# EAGLE design stamp-fixed-mk2 (EAGLE 6.5.0)
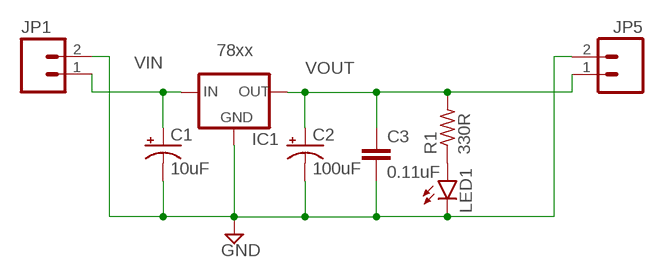
[diagram p0: schematic, sheet 1]

## Parts
C1  10uF  CAPACITOR-POLARIZEDE2.5-6  [E2,5-6]
C2  100uF  CAPACITOR-POLARIZEDE2.5-6  [E2,5-6]
C3  0.11uF  CAPACITOR-CERAMIC025-024X044  [C025-024X044]
IC1  78xx  V_REG_78XXTO-220-THERM  [TO-220-SIDE-THERM]
JP1  M02JST-PTH-2  [JST-2-PTH]
JP5  M02JST-PTH-2  [JST-2-PTH]
LED1  LED3MM  [LED3MM]
R1  330R  RESISTORPTH-AXIAL-5.08MM  [RESISTOR-AXIAL-PTH-5.08MM]

## Nets
GND: C1.- C2.- C3.2 IC1.GND IC1.GND@1(GND) IC1.GND@2(GND) IC1.GND@3(GND) IC1.GND@4(GND) IC1.GND@5(GND) IC1.GND@6(GND) IC1.GND@7(GND) IC1.GND@8(GND) IC1.GND@9(GND) IC1.GND@10(GND) IC1.GND@11(GND) IC1.GND@12(GND) IC1.GND@13(GND) IC1.GND@14(GND) IC1.GND@15(GND) IC1.GND@16(GND) IC1.GND@17(GND) IC1.GND@18(GND) IC1.GND@19(GND) IC1.GND@20(GND) IC1.GND@21(GND) IC1.GND@22(GND) IC1.GND@23(GND) IC1.GND@24(GND) IC1.GND@25(GND) IC1.GND@26(GND) IC1.GND@27(GND) JP1.2 JP5.2 LED1.K(C)
N$3: LED1.A R1.P$1
VIN: C1.+ IC1.IN JP1.1
VOUT: C2.+ C3.1 IC1.OUT JP5.1 R1.P$2

## Library data of the parts
C1 C2 = A_butts:CAPACITOR-POLARIZED: POLARIZED CAPACITOR, American symbol
C3 = A_butts:CAPACITOR-CERAMIC: CAPACITOR, European symbol
IC1 = A_butts:V_REG_78XX: Voltage Regulator Standard 7805 5V regulator. IGO (Input Ground Output). Spark Fun Electronics SKU : COM-00107
JP1 JP5 = A_butts:M02: Standard 2-pin 0.1" header. Use with - straight break away headers ( PRT-00116) - right angle break away headers (PRT-00553) - swiss pins (PRT-00743) - machine pins (PRT-00117) - female headers (PRT-00115) Molex polarized connector foot print use with: PRT-08233 with associated crimp pins and housings. 2.54_SCREWTERM for use with PRT-10571. 3.5mm Screw Terminal footprints for PRT-08084 5mm Screw Terminal footprints for use with PRT-08433; SKU: PRT-09914
LED1 = A_butts:LED: LEDs Standard schematic elements and footprints for 5mm, 3mm, 1206, and 0603 sized LEDs. 5mm - Spark Fun Electronics SKU : COM-00529 (and others)
R1 = A_butts:RESISTOR: RESISTOR, American symbol

## Board
Postage Stamp Power Supply Small linear power supply with flexible layout.
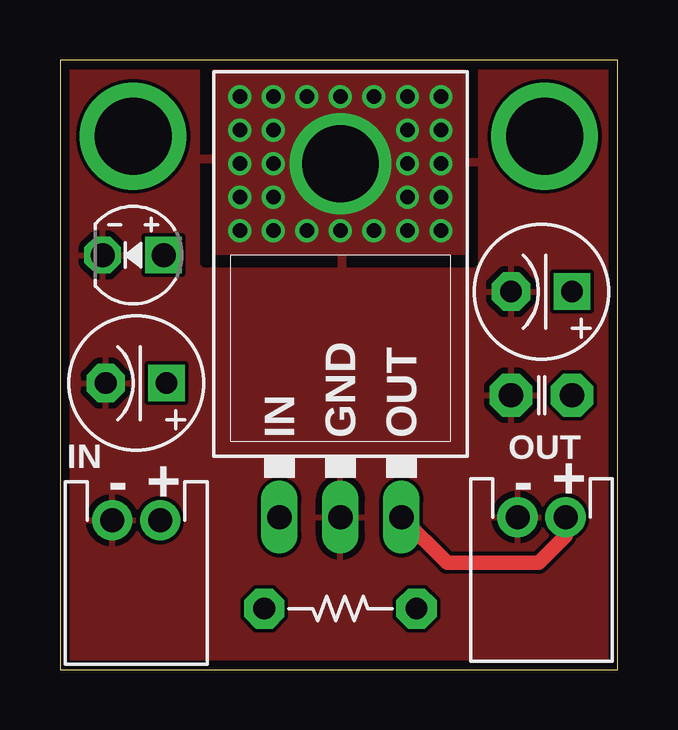
[diagram p1: board, top side]
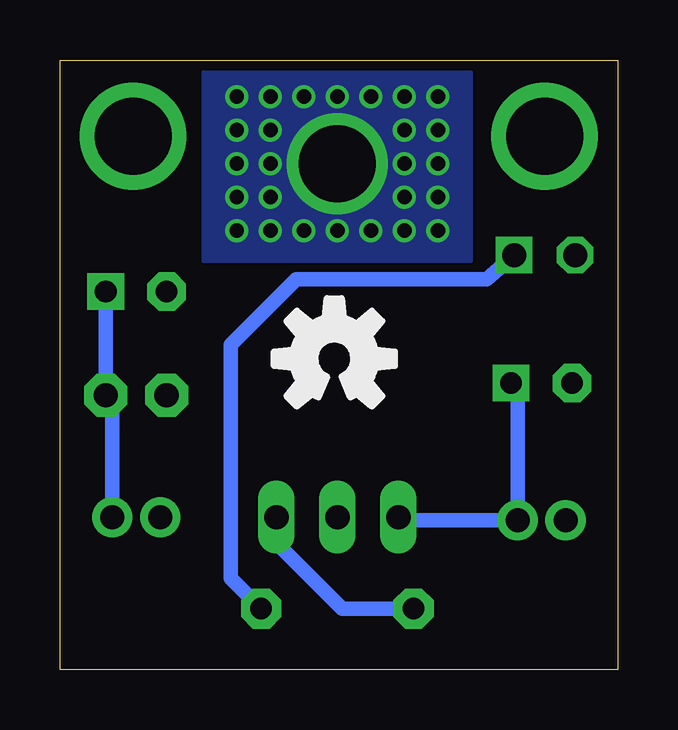
[diagram p2: board, bottom side, seen from below]

Size 23.24 x 25.4 mm. Coordinates in mm from the lower left corner, seen from the top.
Outline: 0,0 23.24,0 23.24,25.4 0,25.4 0,0
Copper layers (1*16): Top 0.0356mm / dielectric 1.5011mm / Bottom 0.0356mm
Design rules "LaenPCBOrder *": minimum track width 6mil, minimum drill 13mil, track to track 6mil, track to pad 6mil, pad to pad 6mil, via to via 6mil, smd to smd 6mil, copper to edge 15mil, drill to drill 6mil, minimum pad ring 7mil, minimum via ring 7mil, stop-mask expansion 3mil, vias tented up to drill 20mil, thermal gap 10mil

### Footprints (pad centres in the part's own frame; a part is rotated, then mirrored left to right if it is on the bottom)
E2,5-6 = drill 0.9 pad 1.524 square: + -1.27,0 | drill 0.9 pad 1.6 octagon: - 1.27,0
C025-024X044 = drill 1.016 pad 1.778 octagon: 1 -1.27,0; 2 1.27,0
TO-220-SIDE-THERM = drill 1.016 long: GND 0,0; IN -2.54,0; OUT 2.54,0 | drill 3.2: GND@1 0,14.732 | drill 0.6: GND@2 -4.191,13.335; GND@3 2.794,11.938; GND@4 -4.191,11.938; GND@5 -1.397,11.938; GND@6 1.397,11.938; GND@7 -2.794,11.938; GND@8 0,11.938; GND@9 -2.794,13.335; GND@10 -4.191,14.732; GND@11 -2.794,14.732; GND@12 -4.191,16.129; GND@13 -2.794,16.129; GND@14 4.191,11.938; GND@15 2.794,13.335; GND@16 4.191,13.335; GND@17 2.794,14.732; GND@18 4.191,14.732; GND@19 2.794,16.129; GND@20 4.191,16.129; GND@21 -4.191,17.526; GND@22 -2.794,17.526; GND@23 2.794,17.526; GND@24 4.191,17.526; GND@25 -1.397,17.526; GND@26 1.397,17.526; GND@27 0,17.526
JST-2-PTH = drill 1 pad 1.676: 1 -1,0; 2 1,0
LED3MM = drill 1 pad 1.524 square: A -1.27,0 | drill 1 pad 1.524 octagon: K 1.27,0
RESISTOR-AXIAL-PTH-5.08MM = drill 0.9 pad 1.676 octagon: P$1 -3.175,0; P$2 3.175,0

### Placement (x,y rotation side)
C1  3.17,11.94 180 top
C2  20.07,15.75 180 top
C3  20.07,11.43 180 top
IC1  11.68,6.35 0 top
JP1  3.17,6.22 180 top
JP5  20.07,6.35 180 top
LED1  3.05,17.27 180 top
R1  11.68,2.54 180 top
U$1  [OSHWLOGO_BOT_0.2_A]  11.81,12.95 0 top

### Tracks (layer width: path | path; a pad name or v marks a point on that pad's centre or on a via)
GND
  pour Top: 0,25.4 23.24,25.4 23.24,0 0,0
  pour Bottom (no thermals): 6.1,24.89 6.1,17.02 17.27,17.02 17.27,24.89
  pour Top (no thermals): 5.84,24.89 5.84,17.27 17.53,17.27 17.53,24.89
N$1
  cutout Top: 5.84,21.08 6.35,21.08 6.35,17.27 11.56,17.27 11.56,16.76 5.97,16.76 5.84,16.89
N$2
  cutout Top: 11.94,16.76 11.94,17.27 16.89,17.27 16.89,20.95 17.4,20.95 17.4,16.89 17.27,16.76
N$3
  Bottom 0.61: LED1.A 5.46,16.26 13.4,16.26 16.13,13.53 16.13,3.81 R1.P$1
N$4
  cutout Top: 16.89,21.34 17.4,21.34 17.4,25.02 16.89,25.02
N$6  (via drill 3.2 pad 4.45)
  other vias: 3.05,22.23
N$7  (via drill 3.2 pad 4.45)
  other vias: 20.19,22.23
N$8
  cutout Top: 5.84,25.02 5.84,21.46 6.35,21.46 6.35,25.02
VIN
  Bottom 0.61: C1.+ 4.17,11.67 JP1.1 9.02,6.22 IC1.IN
VOUT
  Top 0.61: JP5.1 21.07,5.57 19.94,4.45 16.13,4.45 IC1.OUT
  Bottom 0.61: JP5.1 21.07,11.16 C3.1 C2.+ | IC1.OUT 14.22,5.29 11.48,2.54 R1.P$2

### Text on the board
tPlace: IN | OUT | - | + | - | +